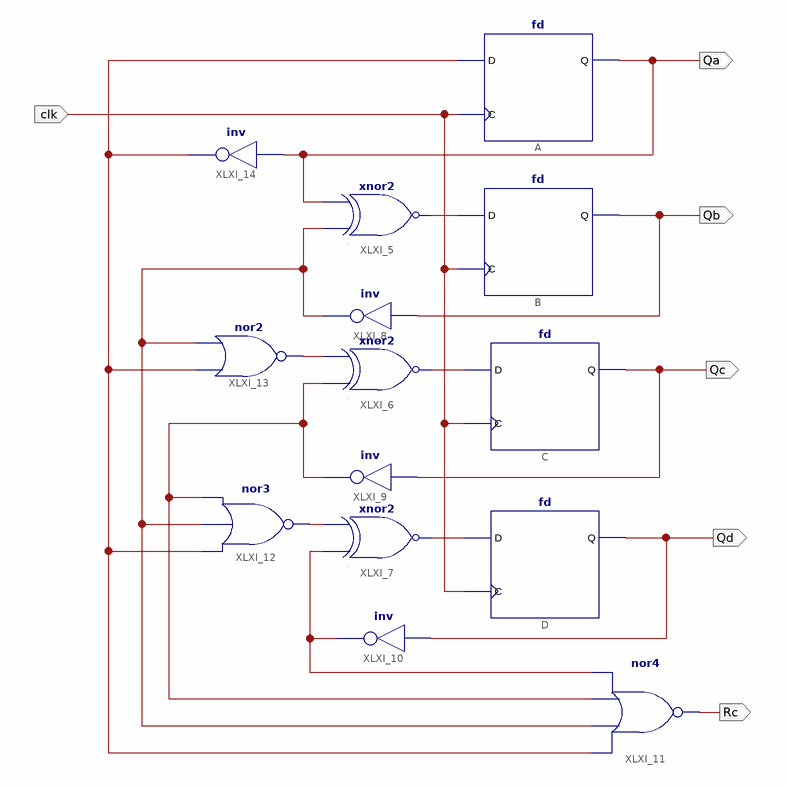
[diagram p0: schematic sheet 1]
// Xilinx ISE schematic Counter_4bit.sch (kintex7) as structural Verilog: 14 symbols, 6 ports
module Counter_4bit (
  input  clk,
  output Qa,
  output Qb,
  output Qc,
  output Qd,
  output Rc
);

  wire XLXN_9, XLXN_10, XLXN_11, XLXN_20, XLXN_24, XLXN_87, XLXN_97, XLXN_99, XLXN_103;

  fd B (.C(clk), .D(XLXN_9), .Q(Qb));
  fd A (.C(clk), .D(XLXN_87), .Q(Qa));
  fd C (.C(clk), .D(XLXN_10), .Q(Qc));
  xnor XLXI_5 (XLXN_9, XLXN_103, Qa);
  not XLXI_8 (XLXN_103, Qb);
  xnor XLXI_6 (XLXN_10, XLXN_99, XLXN_24);
  fd D (.C(clk), .D(XLXN_11), .Q(Qd));
  not XLXI_10 (XLXN_97, Qd);
  xnor XLXI_7 (XLXN_11, XLXN_97, XLXN_20);
  not XLXI_9 (XLXN_99, Qc);
  nor XLXI_12 (XLXN_20, XLXN_87, XLXN_103, XLXN_99);
  nor XLXI_13 (XLXN_24, XLXN_87, XLXN_103);
  not XLXI_14 (XLXN_87, Qa);
  nor XLXI_11 (Rc, XLXN_87, XLXN_103, XLXN_99, XLXN_97);
endmodule
